# Altium project 扩展板.PrjPcb
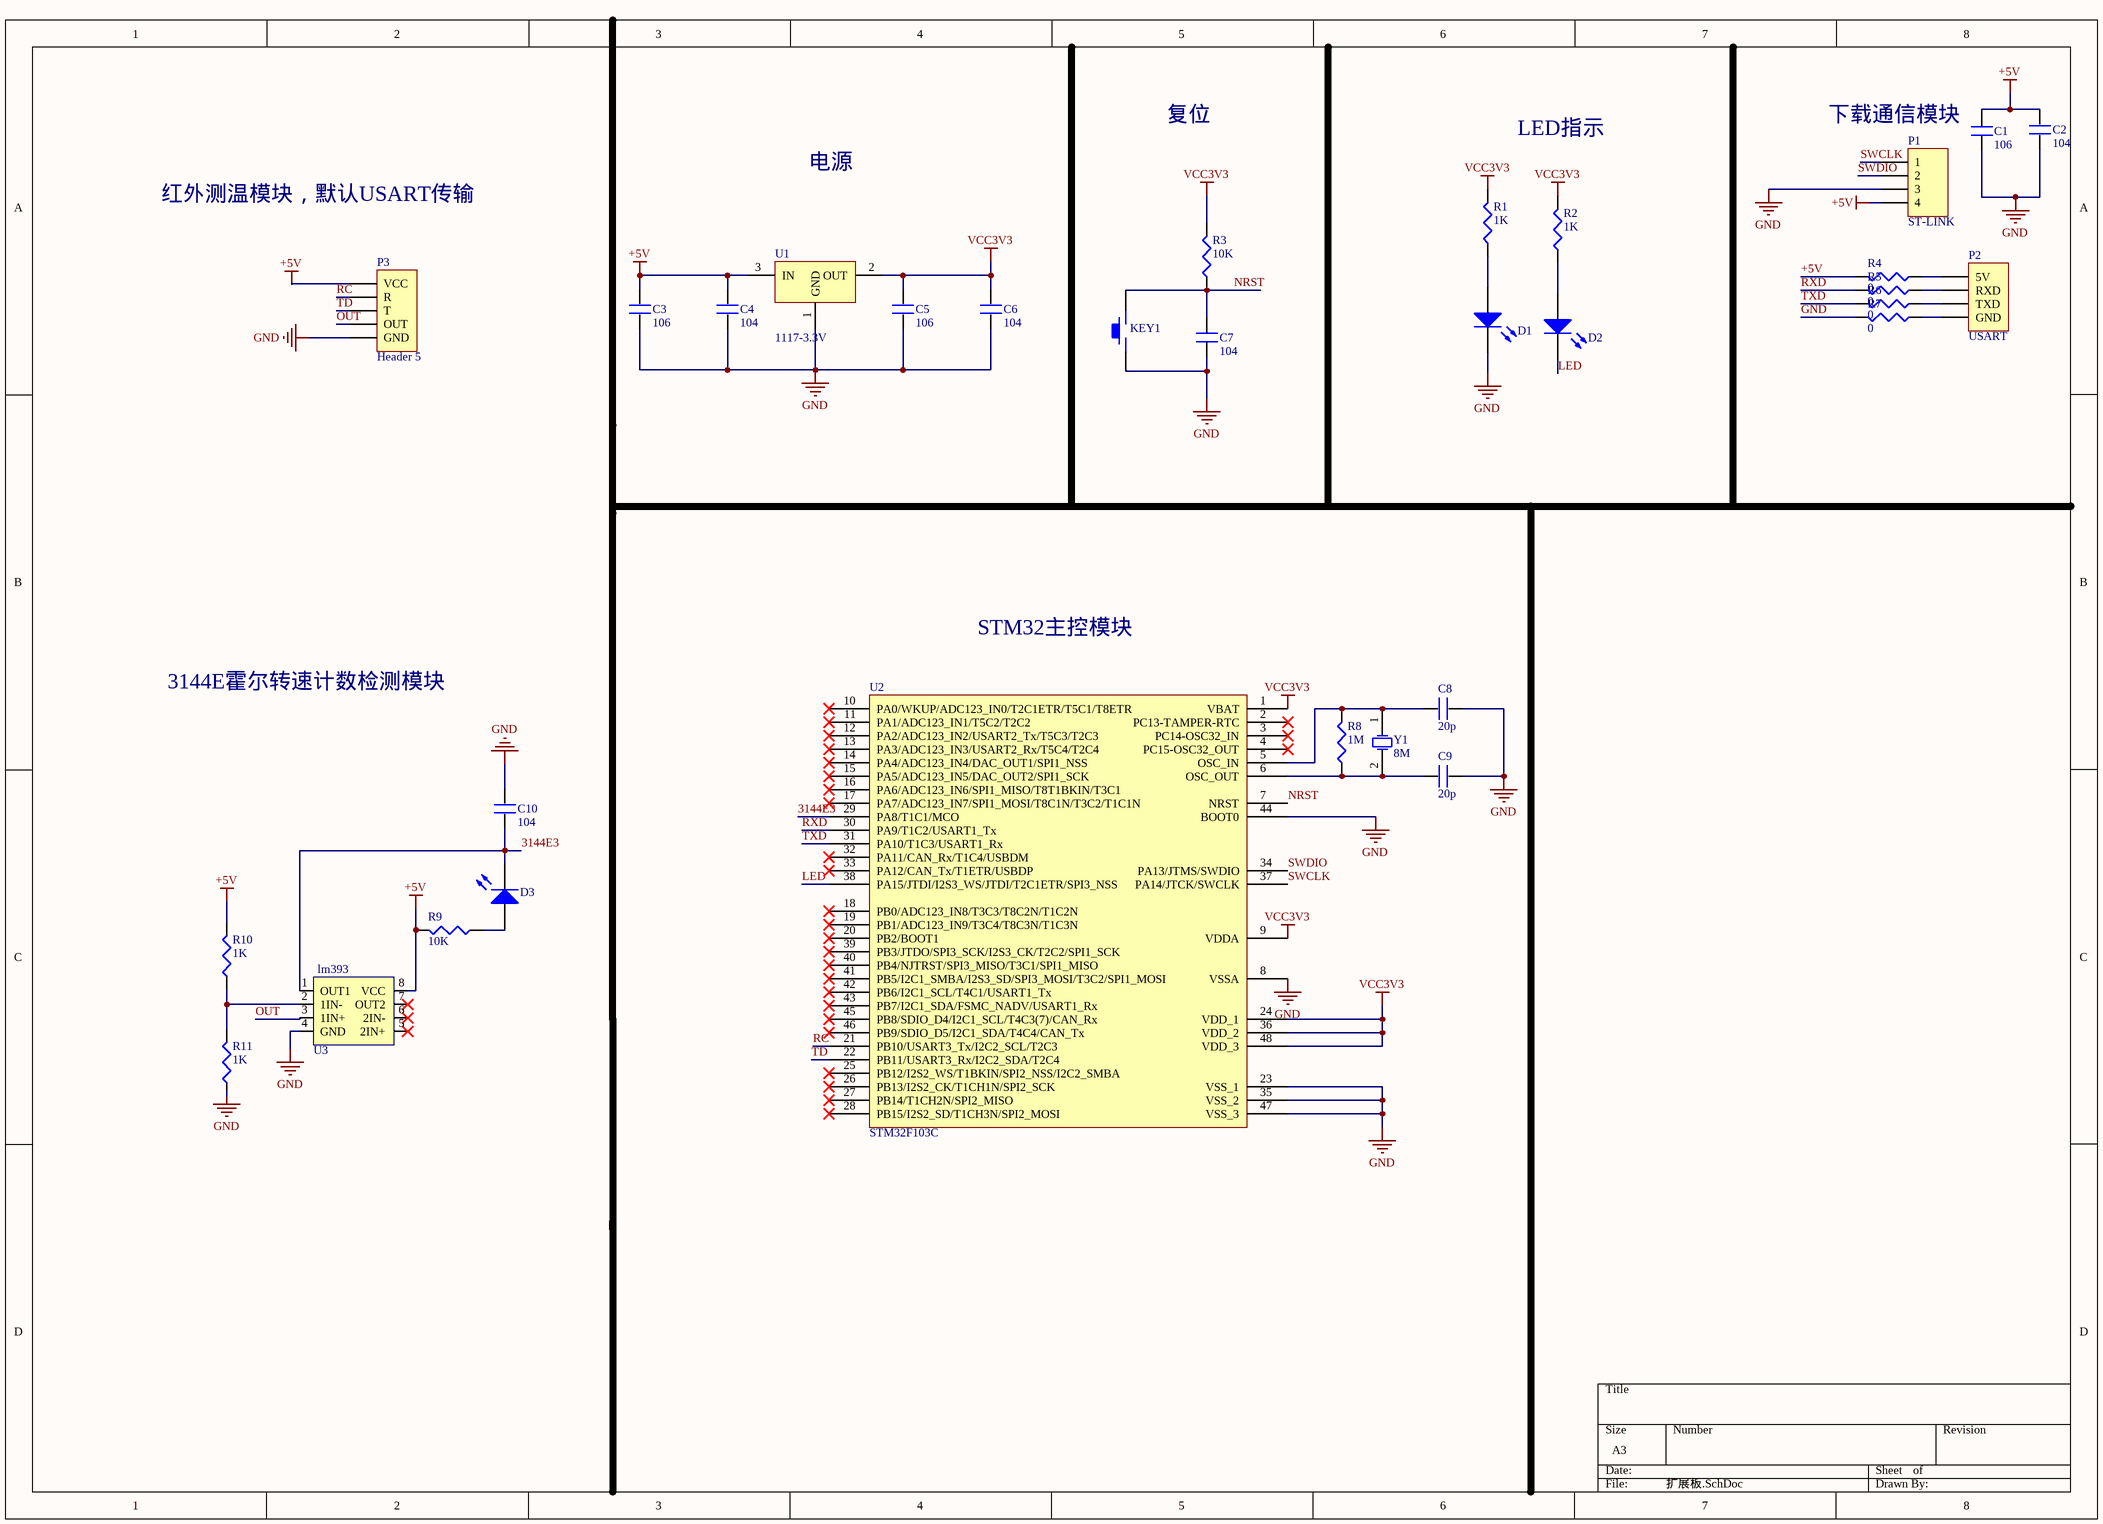
[diagram p0: 扩展板.SchDoc]
1 sheet, 32 parts. Net scope: global (net labels, ports and power ports of the same name join across sheets).
Board file: 扩展板.PcbDoc

## Sheet 扩展板.SchDoc
size A3

### Parts
C1  106  [C0603(1608)]
C2  104  [C0603(1608)]
C3  106  [C0603(1608)]
C4  104  [C0603(1608)]
C5  106  [C0603(1608)]
C6  104  [C0603(1608)]
C7  104  [C0603(1608)]
C8  20p  [C0603(1608)]
C9  20p  [C0603(1608)]
C10  104  [C0603(1608)]
D1  LED0603  [LED_0805]  (value not drawn)
D2  LED0603  [LED_0805]  (value not drawn)
D3  LED0603  [LED_0805]  (value not drawn)
KEY1  KEY_M  [贴片按键]  (value not drawn)
P1  ST-LINK  [HDR1X4]
P2  USART  [HDR1X4]
P3  Header 5  [HDR1X5]
R1  1K  [J1-0603]
R2  1K  [J1-0603]
R3  10K  [J1-0603]
R4  0  [J1-0603]
R5  0  [J1-0603]
R6  0  [J1-0603]
R7  0  [J1-0603]
R8  1M  [J1-0603]
R9  10K  [J1-0603]
R10  1K  [J1-0603]
R11  1K  [J1-0603]
U1  1117-3.3V  [SOT-223]
U2  STM32F103C  [LQFP-48_7x7x05P]
U3  lm393  [SOP-8_150mil]
Y1  8M  [XTAL-HC49US2]

### Nets
+5V: C1.2 C2.2 C3.2 C4.2 P1.4 P3.1(VCC) R4.2 R9.2 R10.2 U1.3(IN) U3.8(VCC)
GND: C1.1 C2.1 C3.1 C4.1 C5.1 C6.1 C7.1 C8.1 C9.1 C10.2 D1.2(K) KEY1.1 P1.3 P3.5(GND) R7.2 R11.1 U1.1(GND) U2.8(VSSA) U2.23(VSS_1) U2.35(VSS_2) U2.44(BOOT0) U2.47(VSS_3) U3.4(GND)
VCC3V3: C5.2 C6.2 R1.2 R2.2 R3.2 U1.2(OUT) U2.1(VBAT) U2.9(VDDA) U2.24(VDD_1) U2.36(VDD_2) U2.48(VDD_3)
3144E3: C10.1 D3.2(K) U2.29(PA8/T1C1/MCO) U3.1(OUT1)
LED: D2.2(K) U2.38(PA15/JTDI/I2S3_WS/JTDI/T2C1ETR/SPI3_NSS)
NRST: C7.2 KEY1.2 R3.1 U2.7(NRST)
OUT: P3.4(OUT) U3.3(1IN+)
RC: P3.2(R) U2.21(PB10/USART3_Tx/I2C2_SCL/T2C3)
RXD: R5.2 U2.30(PA9/T1C2/USART1_Tx)
SWCLK: P1.1 U2.37(PA14/JTCK/SWCLK)
SWDIO: P1.2 U2.34(PA13/JTMS/SWDIO)
TD: P3.3(T) U2.22(PB11/USART3_Rx/I2C2_SDA/T2C4)
TXD: R6.2 U2.31(PA10/T1C3/USART1_Rx)
NetC8_2: C8.2 R8.2 U2.5(OSC_IN) Y1.1(OSC1)
NetC9_2: C9.2 R8.1 U2.6(OSC_OUT) Y1.2(OSC2)
NetD1_1: D1.1(A) R1.1
NetD2_1: D2.1(A) R2.1
NetD3_1: D3.1(A) R9.1
NetP2_1: P2.1(5V) R4.1
NetP2_2: P2.2(RXD) R5.1
NetP2_3: P2.3(TXD) R6.1
NetP2_4: P2.4(GND) R7.1
NetR10_1: R10.1 R11.2 U3.2(1IN-)

Not connected (* = marked no-connect by the designer): U2 2(PC13-TAMPER-RTC)* 3(PC14-OSC32_IN)* 4(PC15-OSC32_OUT)* 10(PA0/WKUP/ADC123_IN0/T2C1ETR/T5C1/T8ETR)* 11(PA1/ADC123_IN1/T5C2/T2C2)* 12(PA2/ADC123_IN2/USART2_Tx/T5C3/T2C3)* 13(PA3/ADC123_IN3/USART2_Rx/T5C4/T2C4)* 14(PA4/ADC123_IN4/DAC_OUT1/SPI1_NSS)* 15(PA5/ADC123_IN5/DAC_OUT2/SPI1_SCK)* 16(PA6/ADC123_IN6/SPI1_MISO/T8T1BKIN/T3C1)* 17(PA7/ADC123_IN7/SPI1_MOSI/T8C1N/T3C2/T1C1N)* 18(PB0/ADC123_IN8/T3C3/T8C2N/T1C2N)* 19(PB1/ADC123_IN9/T3C4/T8C3N/T1C3N)* 20(PB2/BOOT1)* 25(PB12/I2S2_WS/T1BKIN/SPI2_NSS/I2C2_SMBA)* 26(PB13/I2S2_CK/T1CH1N/SPI2_SCK)* 27(PB14/T1CH2N/SPI2_MISO)* 28(PB15/I2S2_SD/T1CH3N/SPI2_MOSI)* 32(PA11/CAN_Rx/T1C4/USBDM)* 33(PA12/CAN_Tx/T1ETR/USBDP)* 39(PB3/JTDO/SPI3_SCK/I2S3_CK/T2C2/SPI1_SCK)* 40(PB4/NJTRST/SPI3_MISO/T3C1/SPI1_MISO)* 41(PB5/I2C1_SMBA/I2S3_SD/SPI3_MOSI/T3C2/SPI1_MOSI)* 42(PB6/I2C1_SCL/T4C1/USART1_Tx)* 43(PB7/I2C1_SDA/FSMC_NADV/USART1_Rx)* 45(PB8/SDIO_D4/I2C1_SCL/T4C3(7)/CAN_Rx)* 46(PB9/SDIO_D5/I2C1_SDA/T4C4/CAN_Tx)*; U3 5(2IN+)* 6(2IN-)* 7(OUT2)*

### Notes on the sheet
- 复位
- (near P1) 下载通信模块
- 电源
- LED指示
- 红外测温模块，默认USART传输
- STM32主控模块
- 3144E霍尔转速计数检测模块

### Library data of the parts
C1-C10 = C_无极性_0603
D1-D3 = LED0603: 发光二极管; Published: 8-Jun-2000; LatestRevisionDate: 08-Jul-2005; LatestRevisionNote: Mech Layer 1 removed.; PackageReference: LED-0; Publisher: Altium Limited
P1 P2 = Header 4: Header, 4-Pin; LatestRevisionDate: 17-Jul-2002; LatestRevisionNote: Re-released for DXP Platform.; Publisher: Altium Limited
P3 = Header 5: Header, 5-Pin; LatestRevisionDate: 17-Jul-2002; LatestRevisionNote: Re-released for DXP Platform.; Publisher: Altium Limited
R1 R2 R4-R8 R10 R11 = Res3: Resistor; Value: 10K; Published: 8-Jun-2000; LatestRevisionDate: 29-May-2009; LatestRevisionNote: IPC-7351 Footprint Added.; PackageReference: J1-0603; Publisher: Altium Limited; PackageDescription: Chip Resistor
R3 R9 = Res3: Resistor; Published: 8-Jun-2000; LatestRevisionDate: 29-May-2009; LatestRevisionNote: IPC-7351 Footprint Added.; PackageReference: J1-0603; Publisher: Altium Limited; PackageDescription: Chip Resistor; Value: 10K
U1 = 1117-3.3V: xA 3.3V; Note: Tab is connected to GND; Published: 15-Apr-2002; DatasheetVersion: Jun-1999; PackageVersion: 1995; PackageReference: T03B; Publisher: Altium Limited; PackageDescription: TO, Thru-Hole, Vertical, Heatsink Mounted; 3 In-Line Leads; Pitch 2.54 mm; ComponentLink1Description: Manufacturer Link; ComponentLink1URL: http://www.national.com/; ComponentLink2Description: Datasheet; ComponentLink2URL: http://www.national.com/ds.cgi/LM/LM2940.pdf; ComponentLink3Description: URL Link1; ComponentLink3URL: http://www.national.com/pf/LM/LM2940C.html
U2 = STM32F103C: STM32单片机48引脚
Y1 = XTAL: Crystal Oscillator; Published: 8-Jun-2000; LatestRevisionDate: 17-Jul-2002; LatestRevisionNote: Re-released for DXP Platform.; PackageReference: R38; Publisher: Altium Limited; PackageDescription: Crystal, Thru-Hole; 2 Leads; Body 3.1 x 8.2 mm (Dia.xH)